# Altium schematic sheet CounterS.SchDoc
size A4; SheetNumber: 7; SheetTotal: 12
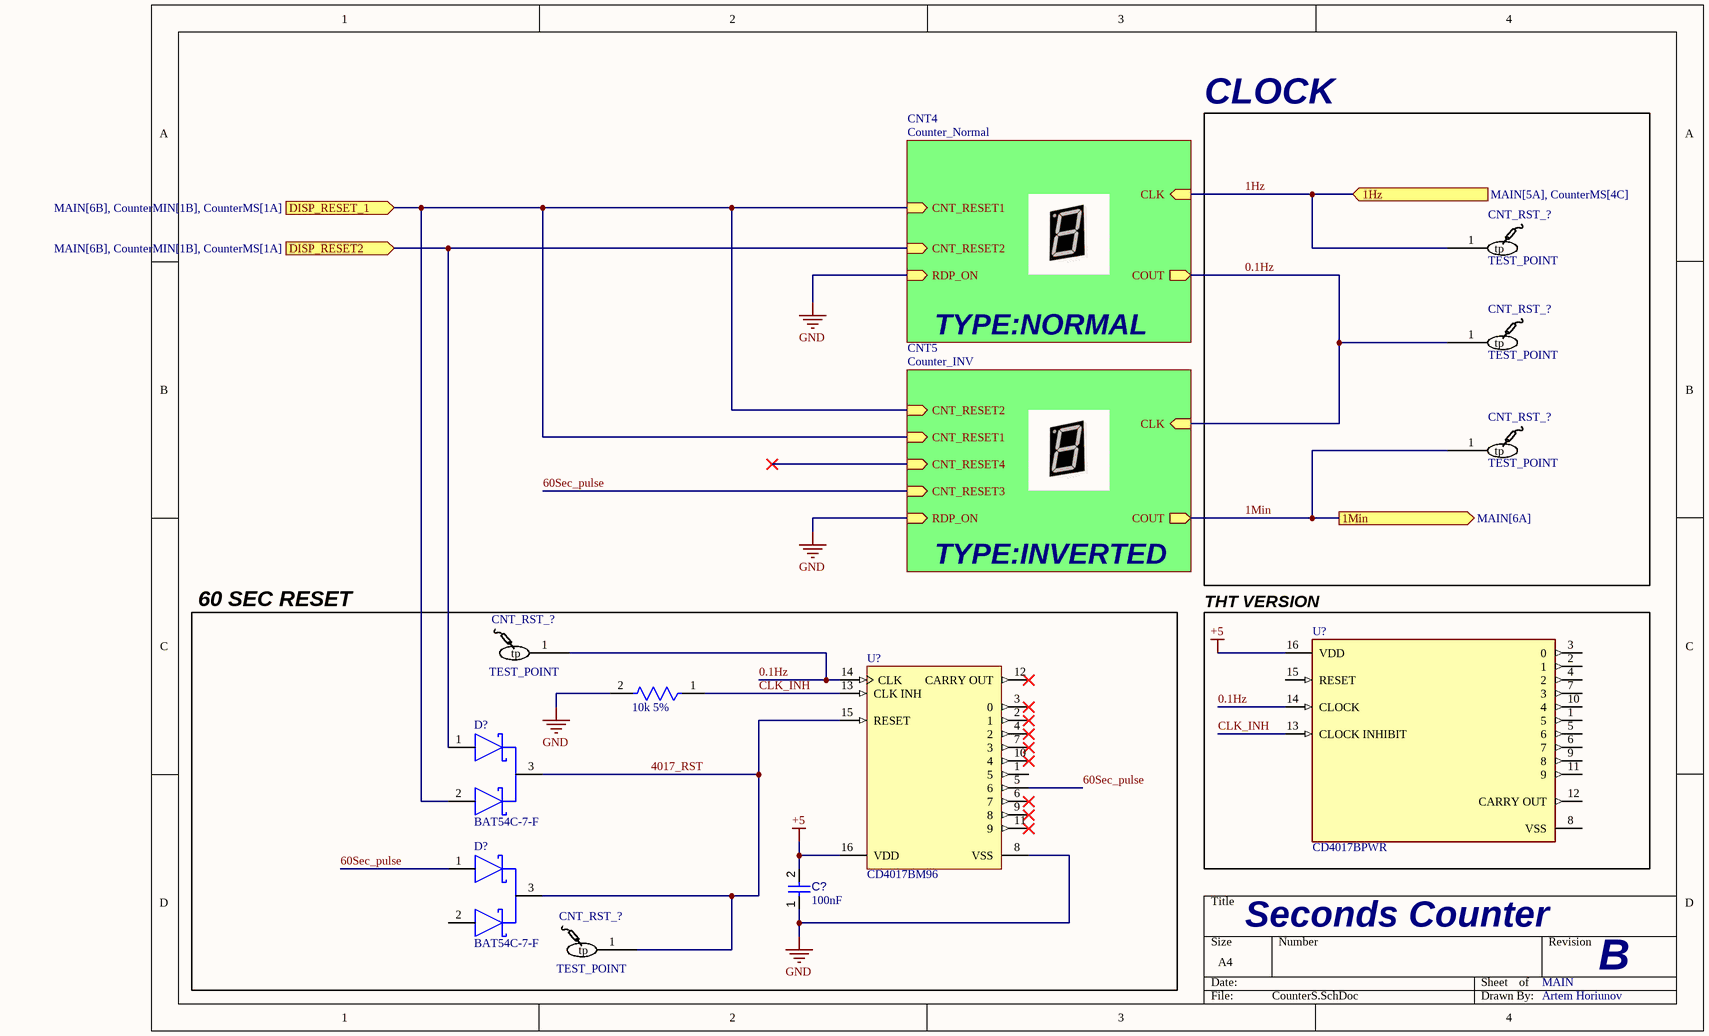
[diagram p0: CounterS.SchDoc]

## Parts
(Parts that share a designator on the sheet are numbered #1, #2 ... from top to bottom, then left to right.)
?  10k 5%  [FP-RC0603-0_55-IPC_C]
C?  value 100nF  [CAPC2013X95X50LL10T25]  (hidden comment: Capacitor 100 nF +/-10% 50 V 0805)
CNT_RST_?#1  TEST_POINT  [TestPoint-Footprint-1]
CNT_RST_?#2  TEST_POINT  [TestPoint-Footprint-1]
CNT_RST_?#3  TEST_POINT  [TestPoint-Footprint-1]
CNT_RST_?#4  TEST_POINT  [TestPoint-Footprint-1]
CNT_RST_?#5  TEST_POINT  [TestPoint-Footprint-1]
D?#1  BAT54C-7-F  [FP-SOT23-IPC_B]
D?#2  BAT54C-7-F  [FP-SOT23-IPC_B]
U?#1  CD4017BPWR  [FP-PW0016A-IPC_B]
U?#2  CD4017BM96  [D0016A_L]

## Blocks framed on the sheet
CLOCK: CNT_RST_?#1-CNT_RST_?#3

## Sub-sheets
CNT4 = Counter_Normal: COUT (out), CNT_RESET1 (in), CNT_RESET2 (in), CLK (in), RDP_ON (in)
CNT5 = Counter_INV: COUT (out), CNT_RESET1 (in), CNT_RESET2 (in), CLK (in), RDP_ON (in), CNT_RESET4 (in), CNT_RESET3 (in)

## Ports
1Hz (in, see MAIN[5A], CounterMS[4C]), 1Min (out, see MAIN[6A]), DISP_RESET2 (in, see MAIN[6B], CounterMIN[1B], CounterMS[1A]), DISP_RESET_1 (in, see MAIN[6B], CounterMIN[1B], CounterMS[1A])

## Nets
+5: C?.2 U?#1.16(VDD) U?#2.16(VDD)
GND: ?.2 C?.1 U?#2.8(VSS) ; sheet CNT4/RDP_ON, sheet CNT5/RDP_ON
0.1Hz: CNT_RST_?#2.1(tp) CNT_RST_?#4.1(tp) U?#1.14(CLOCK) U?#2.14(CLK) ; sheet CNT4/COUT, sheet CNT5/CLK
1Hz: CNT_RST_?#1.1(tp) ; port 1Hz, sheet CNT4/CLK
1Min: CNT_RST_?#3.1(tp) ; port 1Min, sheet CNT5/COUT
60Sec_pulse: D?#2.1(1_ANODE) U?#2.5(6) ; sheet CNT5/CNT_RESET3
4017_RST: CNT_RST_?#5.1(tp) D?#1.3(COMMON_CATHODE) D?#2.3(COMMON_CATHODE) U?#2.15(RESET)
CLK_INH: ?.1 U?#1.13(CLOCK_INHIBIT) U?#2.13(CLK_INH)
DISP_RESET2: D?#1.1(1_ANODE) ; port DISP_RESET2, sheet CNT4/CNT_RESET2
DISP_RESET_1: D?#1.2(2_ANODE) ; port DISP_RESET_1, sheet CNT4/CNT_RESET1, sheet CNT5/CNT_RESET1, sheet CNT5/CNT_RESET2

Not connected (* = marked no-connect by the designer): D?#2 2(2_ANODE); U?#1 1(5) 2(1) 3(0) 4(2) 5(6) 6(7) 7(3) 8(VSS) 9(8) 10(4) 11(9) 12(CARRY_OUT) 15(RESET); U?#2 1(5) 2(1)* 3(0)* 4(2)* 6(7)* 7(3)* 9(8)* 10(4)* 11(9)* 12(CARRY_OUT)*

## Notes on the sheet
- TYPE:NORMAL
- 60 SEC RESET
- TYPE:INVERTED
- (near U?#1) THT VERSION
- Seconds Counter
- MAIN
- B
- Artem Horiunov

## Library data of the parts
? = CMP-2100-03664-2: RES 10K OHM 1% 1/10W 0603; Voltage Rating: 75V; Voltage Rating (DC): 50V; Resistance: 10kR; Power Rating: 100mW; Temperature Coefficient: 100ppm/°C; Depth: 0.8mm; Termination: SMD/SMT; Resistor Type: Thick Film; Series: RC; Construction: Rectangular; Features: Moisture Resistant; Packaging: Tape and Reel; Min Operating Temperature: -55°C; Number of Terminations: 2; Lead Pitch: 0.3mm; RoHS Compliant: Yes; Case/Package: 0603; Resistance Tolerance: 1%; Military Standard: Not; Weight: 7.1E-05oz; Number of Pins: 2; Tolerance: 1%; Length: 1.6mm; Case Code (Imperial): 0603; Lead Free: Lead Free; Width: 0.8mm; Max Power Dissipation: 100mW; Height: 0.45mm; Max Operating Temperature: 155°C; Case Code (Metric): 1608; Size Code: 0603
C? = CMP-001-00018-6: Chip Capacitor, 100 nF, +/- 10%, 50 V, 0805 (2012 Metric); Capacitor Type: Ceramic; Voltage Rating: 50V; Pins: 2; Max Operating Temperature: 125°C; Min Operating Temperature: -55°C; Mounting Technology: SM; Case/Package: 0805; RoHS Compliant: True; Tolerance: 10%
CNT_RST_?#1-CNT_RST_?#5 = CMP-00001-5: Pad for testing
D?#1 D?#2 = CMP-12790-000084-1: DIODE ARRAY SCHOTTKY 30V SOT23-3; Max Reverse Current: 2uA; Power Dissipation: 200mW; Average Rectified Current: 200mA; Capacitance: 10pF; Peak Non-Repetitive Surge Current: 600mA; Forward Voltage: 800mV; Reverse Recovery Time: 5ns; Element Configuration: Common Cathode; Max Operating Temperature: 150°C; Max Reverse Voltage (DC): 30V; Power Rating: 200mW; Termination: SMD/SMT; REACH SVHC: No SVHC; Voltage Rating (DC): 30V; Series: -; Current Rating: 200mA; RoHS Compliant: Yes; Max Power Dissipation: 200mW; Case/Package: SOT-23; Max Repetitive Reverse Voltage (Vrrm): 30V; Width: 1.3mm; Min Operating Temperature: -65°C; Lead Free: Lead Free; Forward Current: 200mA; Number of Pins: 3; Contact Plating: Tin; Package Quantity: 3000; Length: 2.9mm; Radiation Hardening: No; Max Forward Surge Current (Ifsm): 600mA; Height: 1mm; Packaging: Tape and Reel; Mount: Surface Mount; Weight: 0.000282oz
U?#1 = CMP-1623-00681-3: IC 10-OUT DECADE COUNTER 16TSSOP; Reset: Asynchronous; Number of Bits: 10; Turn-On Delay Time: 650ns; Clock Edge Trigger Type: Positive Edge; Min Supply Voltage: 3V; Frequency: 11MHz; Number of Elements: 1; Direction: Up; Max Supply Voltage: 18V; Sync/Async: Synchronous; Quiescent Current: 100uA; Packaging: Tape and Reel; Max Operating Temperature: 125°C; RoHS Compliant: Yes; Min Operating Temperature: -55°C; Contact Plating: Gold; Weight: 0.002183oz; Mount: Surface Mount; Technology: CMOS; Lead Free: Lead Free; Package Quantity: 2000; Propagation Delay: 650ns; Case/Package: TSSOP; Series: 4000B; Logic Function: Counter; Number of Bits per Element: 10; Number of Pins: 16
U?#2 = CMP-1623-00072-2: CMOS Decade Counter with 10 Decoded Outputs, D0016A, LARGE T&R; Manufacturer: Texas Instruments; Technology Family: CD4000; Schmitt Trigger: No; VCC(Max)(V): 18; Inputs: 1; tpd @ Nom Voltage(Max)(ns): 270; Rating: Military; Bits(#): 10; Output Drive (IOL/IOH)(Max)(mA): 1.5/-1.5; ICC @ Nom Voltage(Max)(mA): 0.03; F @ Nom Voltage(Max)(Mhz): 8; VCC(Min)(V): 3; Output Type: CMOS; Operating Temperature Range(C): -55 to 125; Generic Part Number: CD4017B; Type: Decade; DatasheetVersion: SCHS027C; Input Type: CMOS; Function: Counter; PackageReference: D0016A; Code_JEDEC: MS-012 variation AC; Voltage(Nom)(V): 10